# EAGLE design headerboard (EAGLE 9.6.2)
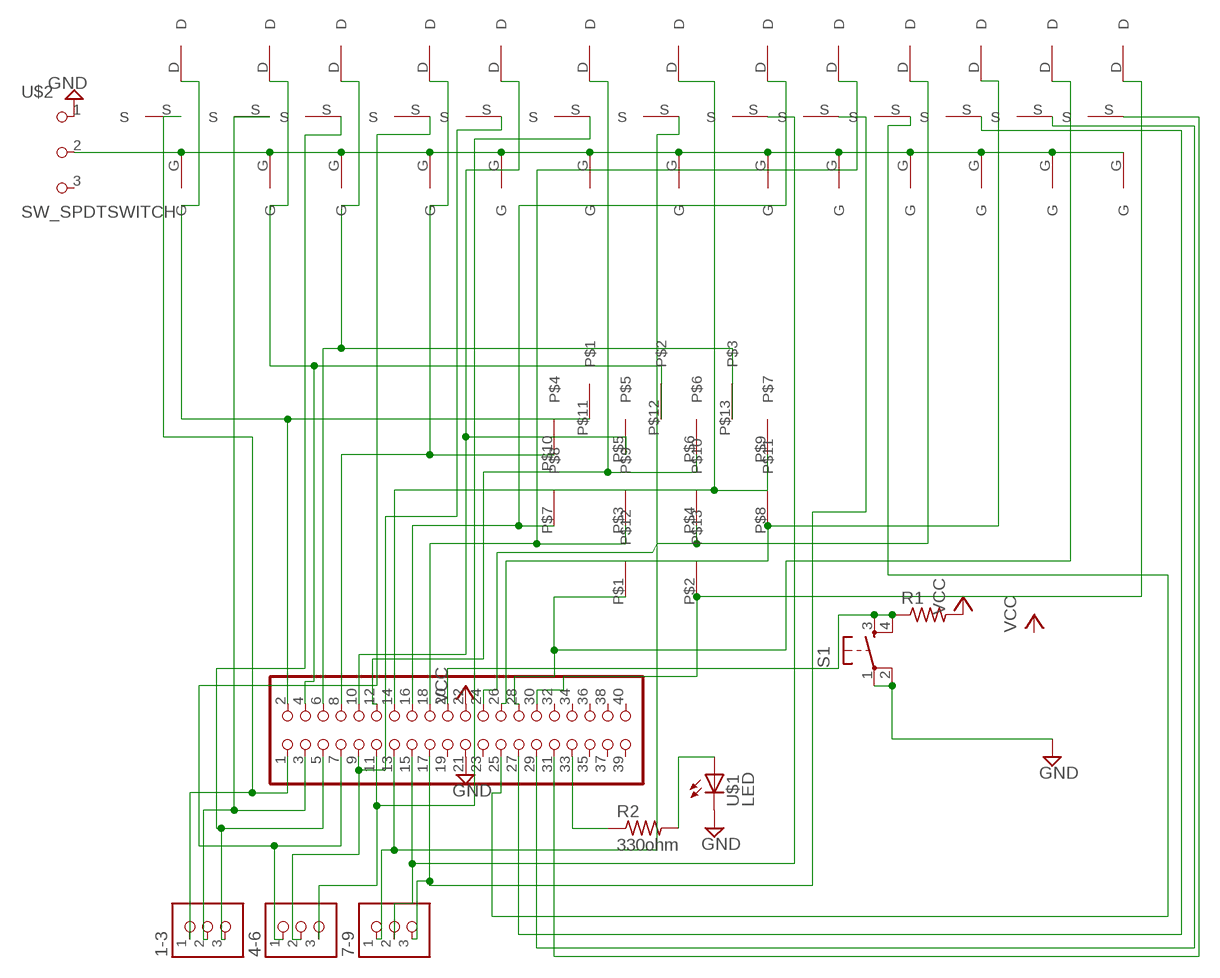
[diagram p0: schematic, sheet 1]

## Parts
1-3  CONN_03_TERM'-FABLAB'  [ED555DS-3DS]
4-6  CONN_03_TERM'-FABLAB'  [ED555DS-3DS]
7-9  CONN_03_TERM'-FABLAB'  [ED555DS-3DS]
JP1  PINHD-2X20  [2X20]
R1  R1206FAB  [R1206FAB]
R2  330ohm  R1206FAB  [R1206FAB]
S1  SW_SWITCH_TACTILE_6MM6MM_SWITCH  [6MM_SWITCH]
U$1  LED  [LED1206]
U$2  SW_SPDTSWITCH  [SPDTSWITCH]
U$3  SOT23NMOS  [SOT23NMOS]
U$4  SOT23NMOS  [SOT23NMOS]
U$5  SOT23NMOS  [SOT23NMOS]
U$6  SOT23NMOS  [SOT23NMOS]
U$7  SOT23NMOS  [SOT23NMOS]
U$8  SOT23NMOS  [SOT23NMOS]
U$9  SOT23NMOS  [SOT23NMOS]
U$10  SOT23NMOS  [SOT23NMOS]
U$11  SOT23NMOS  [SOT23NMOS]
U$12  SOT23NMOS  [SOT23NMOS]
U$13  SOT23NMOS  [SOT23NMOS]
U$14  SOT23NMOS  [SOT23NMOS]
U$15  SOT23NMOS  [SOT23NMOS]
U$19  13PINHEADER  [13HEADER]

## Nets
GND: JP1.21 S1.1(P) S1.2(P1) U$1.2(C) U$2.1
N$1: U$2.2 U$3.G U$4.G U$5.G U$6.G U$7.G U$8.G U$9.G U$10.G U$11.G U$12.G U$13.G U$14.G U$15.G
N$2: JP1.2 U$3.D U$19.P$11
N$3: JP1.4 U$4.D U$19.P$12
N$4: JP1.6 U$5.D U$19.P$13
N$5: JP1.8 U$6.D U$19.P$10
N$6: JP1.12 U$8.D U$19.P$6
N$7: JP1.26 U$13.D U$19.P$8
N$8: JP1.14 U$9.D U$19.P$9
N$9: JP1.16 U$10.D U$19.P$7
N$10: JP1.18 U$11.D U$19.P$3
N$11: 1-3.2 JP1.3 U$4.S
N$12: JP1.28 U$14.D U$19.P$1
N$13: JP1.24 U$12.D U$19.P$4
N$14: JP1.30 U$15.D U$19.P$2
N$15: 1-3.3 JP1.5 U$5.S
N$16: JP1.20 R1.1 S1.3(S) S1.4(S1)
N$17: 4-6.1 JP1.7 U$6.S
N$18: 4-6.2 JP1.9 U$7.S
N$19: 4-6.3 JP1.11 U$8.S
N$20: 7-9.1 JP1.13 U$9.S
N$21: JP1.10 U$7.D U$19.P$5
N$22: 7-9.2 JP1.15 U$10.S
N$23: 7-9.3 JP1.17 U$11.S
N$24: JP1.25 U$12.S
N$25: JP1.27 U$13.S
N$26: JP1.29 U$14.S
N$27: JP1.31 U$15.S
N$28: JP1.33 R2.1
N$29: R2.2 U$1.1(A)
N$37: 1-3.1 JP1.1 U$3.S
VCC: JP1.22 R1.2
Unconnected: JP1.19 JP1.23 JP1.32 JP1.34 JP1.35 JP1.36 JP1.37 JP1.38 JP1.39 JP1.40 U$2.3

## Library data of the parts
1-3 4-6 7-9 = fab_new:CONN_03_TERM: 3.5mm terminal block, 3 positions ED555-3DS as found in the fablab inventory. Made by Zaerc.
JP1 = adafruit:PINHD-2X20: PIN HEADER
R1 R2 = fab_new:R: Resistor (US Symbol) Variants with postfix FAB are widened to allow the routing of internal traces
S1 = fab_new:SW_SWITCH_TACTILE_6MM: OMRON SWITCH
U$1 = eagle_fab:LED: LED
U$2 = fab_new:SW_SPDTSWITCH
U$3-U$15 = ContunityTestingRig:SOT23NMOS
U$19 = ContunityTestingRig:13PINHEADER: 13 pin male end for continuity tester

## Board
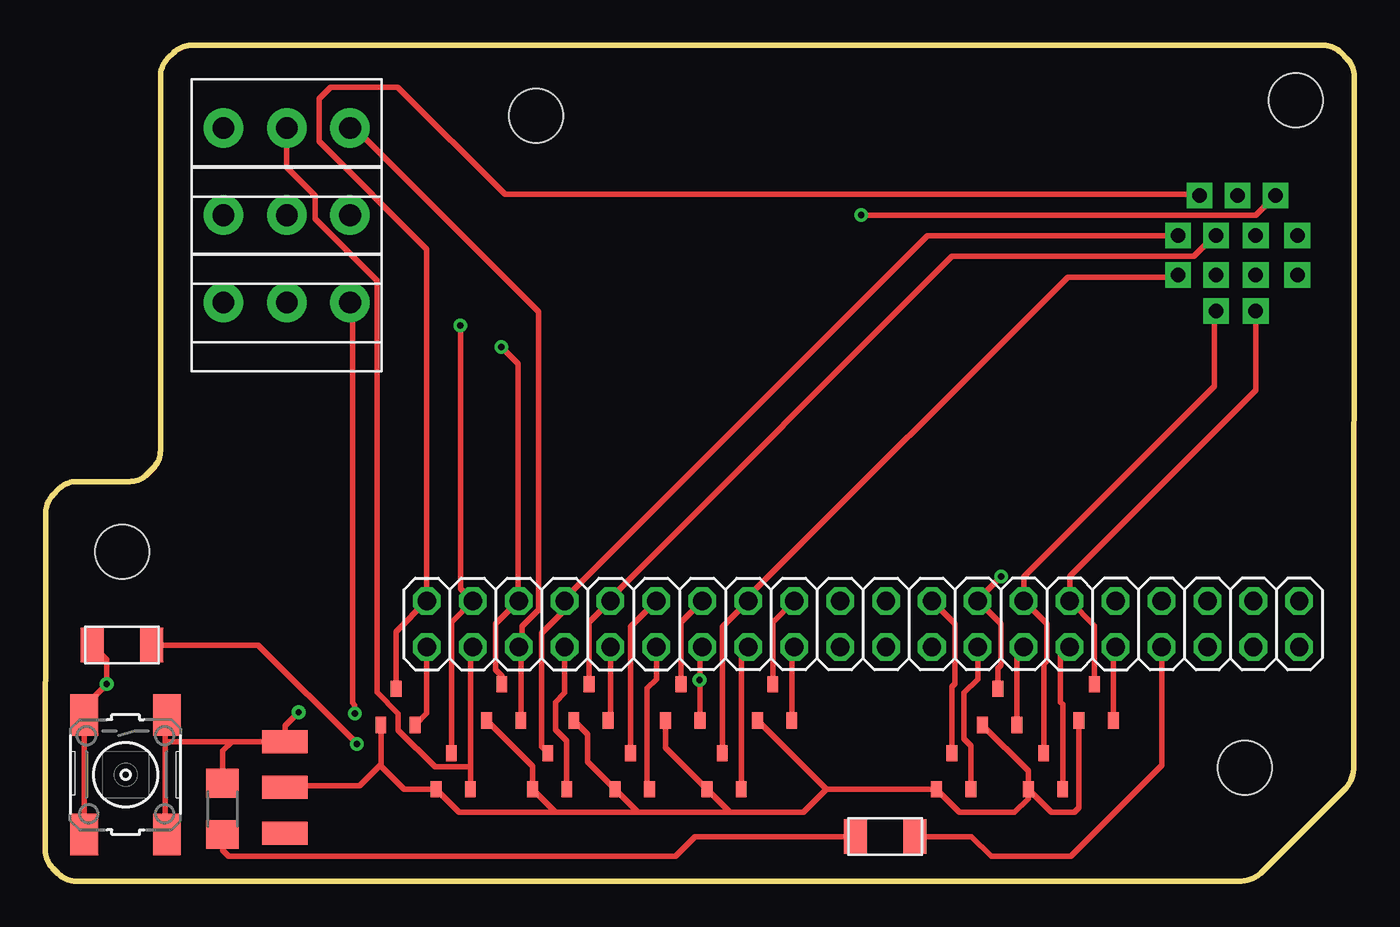
[diagram p1: board, top side]
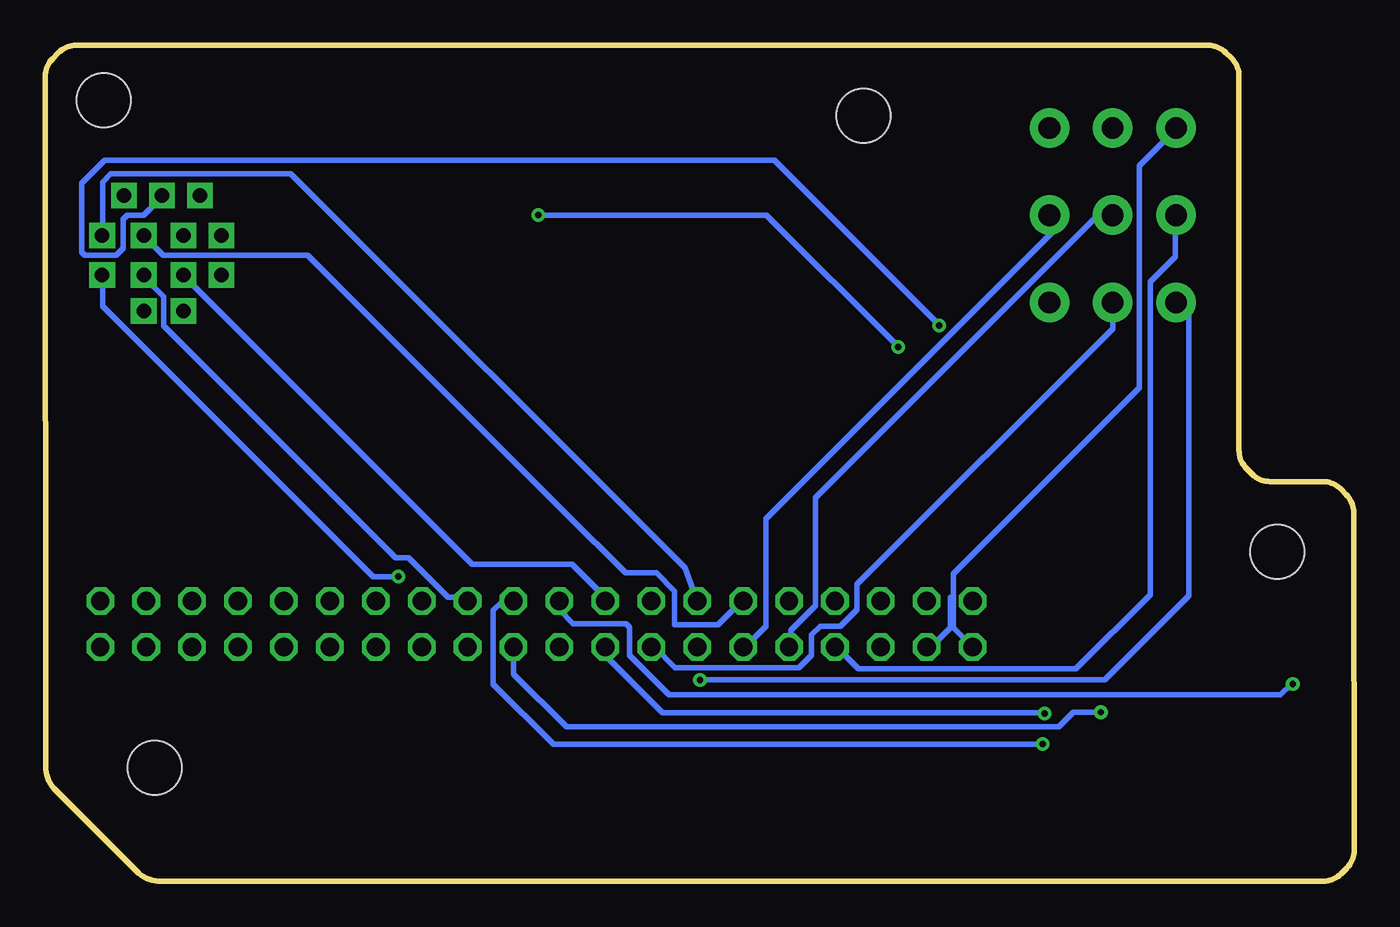
[diagram p2: board, bottom side, seen from below]

Size 72.42 x 46.24 mm. Coordinates in mm from the lower left corner, seen from the top.
Outline: 72.42,44.51 72.39,6.38 arc-45 71.83,5.03 67.36,0.56 arc-45 66.01,0 1.72,0 arc-45 0.73,0.41 0.41,0.73 arc-45 0,1.72 0.03,20.39 arc-45 0.44,21.38 0.76,21.7 arc-45 1.75,22.11 4.66,22.11 arc45 5.64,22.52 5.97,22.84 arc45 6.38,23.83 6.38,44.52 arc-45 6.79,45.5 7.11,45.83 arc-45 8.1,46.24 70.7,46.24 arc-45 71.68,45.83 72.01,45.5 arc-45 72.42,44.51
Copper layers (1*16): Top 0.035mm / dielectric 1.5mm / Bottom 0.035mm
Design rules "default *": minimum track width 12mil, minimum drill 0.35mm, track to track 6mil, track to pad 6mil, pad to pad 6mil, via to via 6mil, smd to smd 6mil, copper to edge 40mil, drill to drill 6mil, minimum pad ring 10mil, minimum via ring 8mil, stop-mask expansion 4mil, vias tented up to drill 0mil, thermal gap 10mil
Holes 3 mm at 4.26,18.23 27.15,42.33 66.35,6.29 69.19,43.19

### Footprints (pad centres in the part's own frame; a part is rotated, then mirrored left to right if it is on the bottom)
ED555DS-3DS = drill 1.2 pad 2.184: 1 -3.5,0; 2 0,0; 3 3.5,0
2X20 = drill 1.016 octagon: 1 -24.13,-1.27; 2 -24.13,1.27; 3 -21.59,-1.27; 4 -21.59,1.27; 5 -19.05,-1.27; 6 -19.05,1.27; 7 -16.51,-1.27; 8 -16.51,1.27; 9 -13.97,-1.27; 10 -13.97,1.27; 11 -11.43,-1.27; 12 -11.43,1.27; 13 -8.89,-1.27; 14 -8.89,1.27; 15 -6.35,-1.27; 16 -6.35,1.27; 17 -3.81,-1.27; 18 -3.81,1.27; 19 -1.27,-1.27; 20 -1.27,1.27; 21 1.27,-1.27; 22 1.27,1.27; 23 3.81,-1.27; 24 3.81,1.27; 25 6.35,-1.27; 26 6.35,1.27; 27 8.89,-1.27; 28 8.89,1.27; 29 11.43,-1.27; 30 11.43,1.27; 31 13.97,-1.27; 32 13.97,1.27; 33 16.51,-1.27; 34 16.51,1.27; 35 19.05,-1.27; 36 19.05,1.27; 37 21.59,-1.27; 38 21.59,1.27; 39 24.13,-1.27; 40 24.13,1.27
R1206FAB = smd 1.27 x 1.905: 1 -1.651,0; 2 1.651,0
6MM_SWITCH = smd 2.286 x 1.524: 1 -3.302,2.286; 2 3.302,2.286; 3 -3.302,-2.286; 4 3.302,-2.286
LED1206 = smd 1.6 x 1.803: 1 -1.422,0; 2 1.422,0
SPDTSWITCH = smd 2.54 x 1.27: 1 0.38,2.54; 2 0.38,0; 3 0.38,-2.54
SOT23NMOS = smd 0.6 x 0.9: D 0.85,2; G 0,0; S 1.9,0
13HEADER = drill 0.8 pad 1.422 square: P$1 3.7,1.15; P$2 5.9,1.15; P$3 3.7,3.145; P$4 5.9,3.145; P$5 3.7,5.32; P$6 5.9,5.32; P$7 1.6,3.145; P$8 8.2,3.145; P$9 8.2,5.32; P$10 1.6,5.32; P$11 2.8,7.545; P$12 4.9,7.545; P$13 7,7.545

### Placement (x,y rotation side)
1-3  13.36,41.67 0 top
4-6  13.36,36.84 0 top
7-9  13.36,32.01 0 top
JP1  45.24,14.23 0 top
R1  4.25,13.07 0 top
R2  46.46,2.48 180 top
S1  4.44,5.9 270 top
U$1  9.81,4.01 90 top
U$2  12.88,5.19 0 top
U$3  18.57,8.65 0 top
U$4  21.62,5.09 0 top
U$5  24.41,8.9 0 top
U$6  26.95,5.09 0 top
U$7  29.24,8.9 0 top
U$8  31.52,5.09 0 top
U$9  34.32,8.9 0 top
U$10  36.6,5.09 0 top
U$11  39.4,8.9 0 top
U$12  49.3,5.09 0 top
U$13  51.84,8.65 0 top
U$14  54.38,5.09 0 top
U$15  57.18,8.9 0 top
U$19  61.07,30.39 0 top

### Tracks (layer width: path | path; a pad name or v marks a point on that pad's centre or on a via)
GND  (via drill 0.35)
  Top 0.305: 6.63,7.73 6.63,9.15 S1.1 | 6.63,7.73 6.63,2.6 S1.2 | 6.63,7.73 10.33,7.73 | 10.33,7.73 U$2.1 13.26,8.6 v14.02,9.36 | U$1.2 9.81,7.21 10.33,7.73
  Bottom 0.305: JP1.21 46.51,11.46 43.59,8.54 16.36,8.54 15.54,9.36 v14.02,9.36
N$1
  Top 0.305: U$3.G 18.57,6.36 | 18.57,6.36 19.84,5.09 U$4.G 22.89,3.82 28.22,3.82 | U$5.G 26.95,6.36 U$6.G 28.22,3.82 | U$7.G 30,8.14 30,6.61 U$8.G 32.79,3.82 | U$9.G 34.32,7.38 U$10.G 37.87,3.82 | U$11.G 43.21,5.09 | 43.21,5.09 U$12.G 50.57,3.82 53.62,3.82 54.38,4.58 U$14.G | U$13.G 54.38,6.11 U$14.G | U$15.G 57.18,4.07 56.92,3.82 55.65,3.82 U$14.G | 43.21,5.09 41.94,3.82 37.87,3.82 | 32.79,3.82 37.87,3.82 | 28.22,3.82 32.79,3.82 | U$2.2 13.34,5.29 17.4,5.29 18.52,6.41 18.57,6.36
N$2
  Top 0.305: U$3.D 19.42,13.81 JP1.2 21.11,34.96 15.14,40.93 15.14,43.27 15.8,43.93 19.48,43.93 25.43,37.98 63.76,37.98 U$19.P$11
N$3  (via drill 0.35)
  Top 0.305: U$4.D 22.47,14.32 JP1.4 22.96,16.19 v22.96,30.74
  Bottom 0.305: v22.96,30.74 22.96,30.77 32.08,39.89 69.12,39.89 70.39,38.62 70.39,34.78 70.23,34.63 68.48,34.63 68.1,35.01 68.1,36.61 67.87,36.84 66.96,36.84 66.04,37.75 U$19.P$12
N$4  (via drill 0.35)
  Top 0.305: U$5.D 25.26,11.35 24.92,11.69 24.92,14.23 JP1.6 26.17,15.53 26.17,28.61 v25.23,29.55 | v45.14,36.84 66.96,36.84 67.87,37.75 U$19.P$13
  Bottom 0.305: 26.14,15.55 JP1.6 | v45.14,36.84 32.52,36.84 v25.23,29.55
N$5
  Top 0.305: U$6.D 27.46,7.43 27.46,13.73 28.73,15 JP1.8 29.11,16.01 48.8,35.7 62.61,35.7 U$19.P$10
  Bottom 0.305: 28.73,15.4 JP1.8
N$6
  Top 0.305: U$8.D 32.37,14.07 JP1.12
  Bottom 0.305: U$19.P$6 66.96,35.7 65.89,34.63 57.89,34.63 41.99,18.73 41.95,18.69 40.31,17.05 38.61,17.05 37.6,16.04 37.6,14.18 35.21,14.18 33.91,15.48 JP1.12
N$7  (via drill 0.35)
  Top 0.305: U$13.D 52.69,11.78 52.86,11.95 52.86,14.23 JP1.26 51.79,15.77 52.87,16.85 v52.89,16.85
  Bottom 0.305: 51.59,15.55 JP1.26 | v52.89,16.85 54.28,16.85 69.24,31.81 69.24,33.41 U$19.P$8
N$8
  Top 0.305: U$9.D 35.17,14.32 JP1.14
  Bottom 0.305: U$19.P$9 69.24,35.93 69.24,38.67 68.79,39.13 58.83,39.13 37.04,17.33 JP1.14
N$9
  Top 0.305: U$10.D 37.45,14.07 JP1.16 38.97,15.81 56.57,33.41 62.61,33.41 U$19.P$7
N$10
  Top 0.305: U$11.D 40.25,14.32 JP1.18 41.38,15.55
  Bottom 0.305: U$19.P$3 64.67,33.41 48.8,17.54 43.28,17.54 41.46,15.71 JP1.18
N$11
  Top 0.305: U$4.S 23.52,6.33 | 23.52,6.33 23.52,12.83 JP1.3 | 23.52,6.33 21.57,6.33 19.54,8.37 19.54,9.28 18.37,10.45 18.37,33.21 14.94,36.64 14.94,37.91 13.36,39.48 1-3.2
  Bottom 0.305: 22.33,15.71 22.33,14.18 22.25,14.11 23.4,12.96 JP1.3
N$12
  Top 0.305: U$14.D 55.23,12.04 55.4,12.2 55.4,14.23 JP1.28 | 54.03,15.55 JP1.28 | U$19.P$1 64.67,31.35 64.67,27.39 54.13,16.85 JP1.28
N$13
  Top 0.305: U$12.D 50.15,10.77 50.32,10.93 50.32,14.23 JP1.24
  Bottom 0.305: U$19.P$4 66.96,33.41 65.87,32.32 65.87,30.72 53.03,17.88 52.32,17.88 50.14,15.71 49.23,15.71 JP1.24
N$14
  Top 0.305: U$15.D 58.03,14.15 JP1.30 56.67,16.88 66.96,27.16 66.96,31.35 U$19.P$2
N$15
  Top 0.305: U$5.S 26.31,12.84 JP1.5 26.37,12.96 26.37,14.11 27.28,15.02 27.28,31.51 17,41.79 1-3.3
N$16  (via drill 0.35)
  Top 0.305: 2.26,2.6 S1.4 S1.3 2.16,9.67 v3.4,10.91 3.4,12.26 R1.1
  Bottom 0.305: JP1.20 43.97,15.02 43.21,14.26 40.29,14.26 40.08,14.06 40.08,12.51 37.9,10.32 4.09,10.32 3.5,10.91 v3.4,10.91
N$17
  Top 0.305: JP1.7 28.73,10.42 28.22,9.92 28.22,8.39 28.85,7.76 U$6.S
  Bottom 0.305: 4-6.1 9.91,36.76 9.91,34.53 11.28,33.16 11.28,15.86 15.4,11.74 27.44,11.74 28.65,12.96 JP1.7
N$18
  Top 0.305: JP1.9 31.27,9.03 U$7.S
  Bottom 0.152: 13.36,36.94 4-6.2
  Bottom 0.305: 4-6.2 14.17,36.84 29.8,21.22 29.8,15.25 31.17,13.88 31.17,12.96 JP1.9
N$19
  Top 0.305: JP1.11 33.81,11.19 33.3,10.68 33.3,5.21 U$8.S
  Bottom 0.305: 4-6.3 16.31,36.29 32.54,20.06 32.54,14.11 33.68,12.96 JP1.11
N$20  (via drill 0.35)
  Top 0.305: U$9.S 36.22,11.13 | 36.22,11.13 36.22,12.83 JP1.13 | v36.2,11.13 36.22,11.13
  Bottom 0.305: 36.1,11.03 v36.2,11.13 13.8,11.13 9.15,15.78 9.15,31.3 7-9.1
N$21
  Top 0.305: U$7.D 30.09,14.32 JP1.10 31.52,15.91 50.17,34.55 63.53,34.55 64.67,35.7 U$19.P$5
N$22
  Top 0.305: U$10.S 38.5,12.58 JP1.15
  Bottom 0.305: 38.79,12.96 JP1.15 38.71,12.96 37.57,11.82 30.71,11.82 30.03,12.51 30.03,13.62 29.54,14.11 28.43,14.11 27.51,15.02 27.51,16.42 13.36,30.57 7-9.2
N$23  (via drill 0.35)
  Top 0.305: U$11.S 41.3,12.83 JP1.17 | v17.12,9.28 17.12,9.74 17,9.86 17,31.96 7-9.3
  Bottom 0.305: v17.12,9.28 17.15,9.31 38.26,9.31 41.23,12.28 41.23,12.96 JP1.17
N$24
  Top 0.305: U$12.S 51.2,7.51 50.83,7.88 50.83,10.42 51.59,11.19 JP1.25
N$25
  Top 0.305: U$13.S 53.74,12.58 JP1.27
N$26
  Top 0.305: U$14.S 56.28,9.79 56.16,9.92 56.16,12.46 JP1.29
N$27
  Top 0.305: U$15.S 59.08,12.83 JP1.31
N$28
  Top 0.305: JP1.33 61.78,12.94 61.78,6.42 56.73,1.38 52.33,1.38 51.24,2.47 R2.1
N$29
  Top 0.305: U$1.1 9.81,1.72 10.15,1.38 34.86,1.38 35.96,2.47 R2.2
N$37
  Top 0.305: U$3.S 21.11,9.29 JP1.1
  Bottom 0.305: JP1.1 22.18,14.03 22.18,17 11.89,27.29 11.89,39.58 9.91,41.56 1-3.1
VCC  (via drill 0.35)
  Top 0.305: R1.2 11.79,13.07 v17.25,7.6
  Bottom 0.305: v17.25,7.6 17.28,7.58 44.3,7.58 47.63,10.91 47.63,15 47.21,15.42 JP1.22